# Altium schematic sheet Power_input.SchDoc
size A4; PageSetup: Record=PageOptions|CenterHorizontal=True|CenterVertical=True|PrintScale=1.00|XCorrection=1.00|YCorrection=1.00|PrintKind=0|BorderSize=5000000|LeftOffset=0|BottomOffset=0|Orientation=2|PaperLength=1000|PaperWidth=1000|Scale=100|PaperSource=7|PrintQuality=-3|MediaType=1|DitherType=10|PrintScaleMode=1|PaperKind=A4|PaperIndex=9
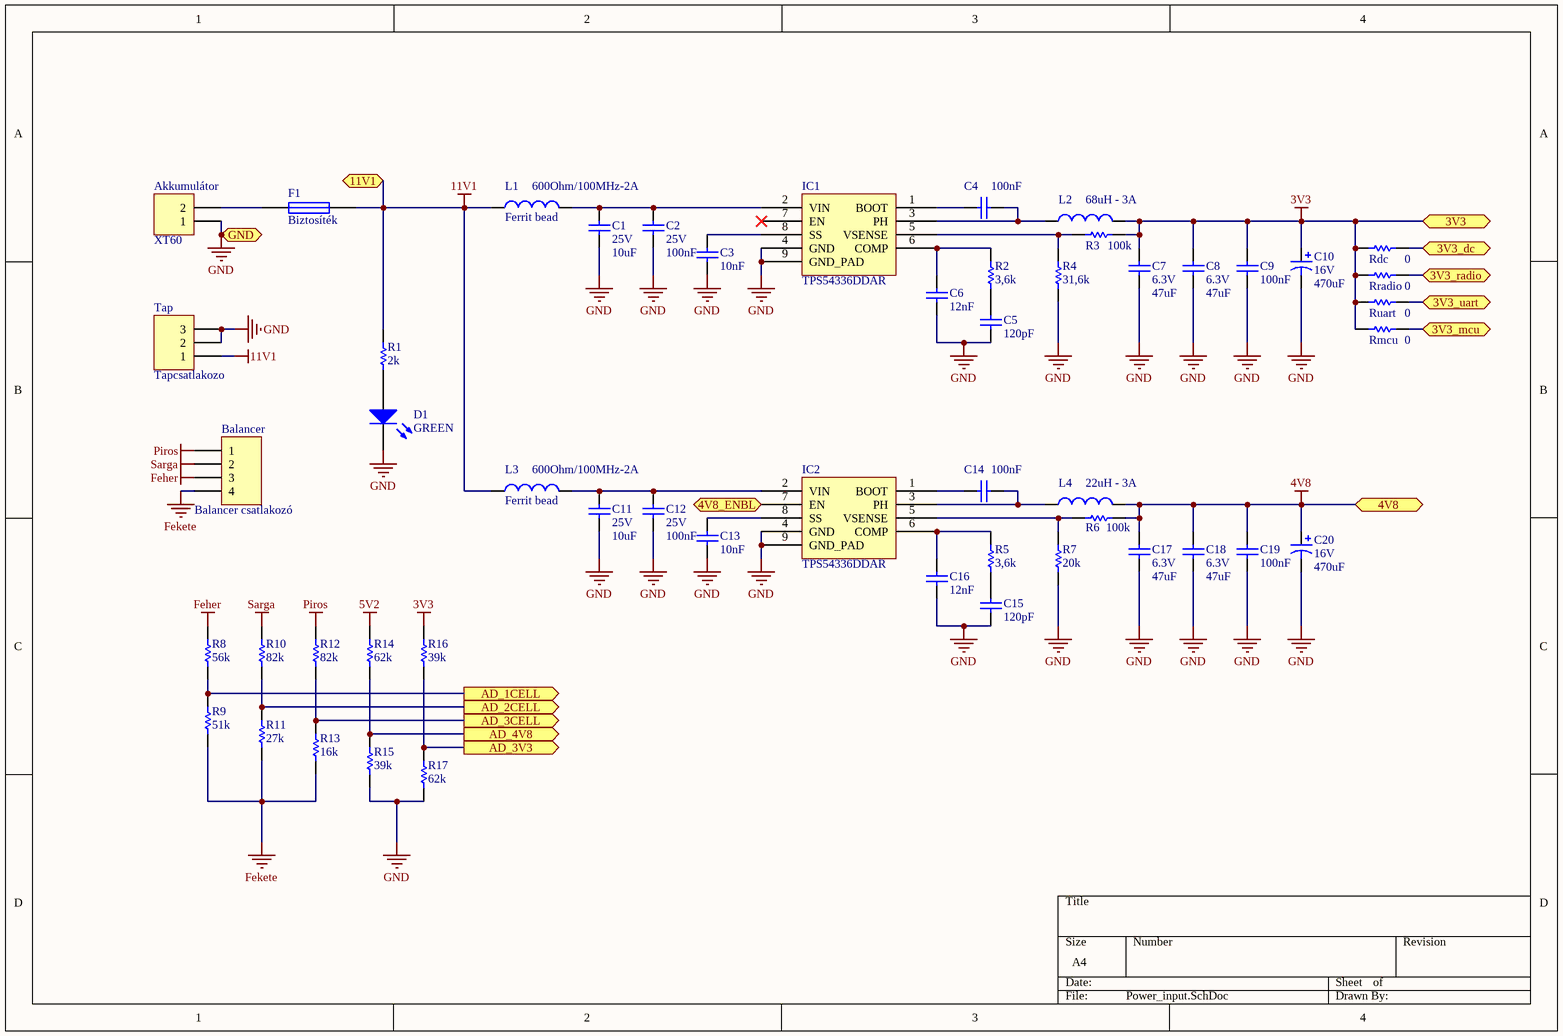
[diagram p0: Power_input.SchDoc]

## Parts
Akkumulátor  XT60  [XT60]
Balancer  Balancer csatlakozó  [FP_CONN4_TUSKE_254MM]
C1  25V  value 10uF  [FP_1206_CAP_125]
C2  25V  value 100nF  [FP_1206_CAP_125]
C3  value 10nF  [FP_0603_CAP_080]  (hidden comment: Cap)
C4  value 100nF  [FP_1206_CAP_125]  (hidden comment: Cap)
C5  value 120pF  [FP_0603_CAP_080]
C6  value 12nF  [FP_0603_CAP_080]
C7  6.3V  value 47uF  [FP_1206_CAP_125]
C8  6.3V  value 47uF  [FP_1206_CAP_125]
C9  value 100nF  [FP_1206_CAP_125]  (hidden comment: Cap)
C10  16V  value 470uF  [power_cap_10mm]
C11  25V  value 10uF  [FP_1206_CAP_125]
C12  25V  value 100nF  [FP_1206_CAP_125]
C13  value 10nF  [FP_0603_CAP_080]  (hidden comment: Cap)
C14  value 100nF  [FP_1206_CAP_125]  (hidden comment: Cap)
C15  value 120pF  [FP_0603_CAP_080]
C16  value 12nF  [FP_0603_CAP_080]
C17  6.3V  value 47uF  [FP_1206_CAP_125]
C18  6.3V  value 47uF  [FP_1206_CAP_125]
C19  value 100nF  [FP_1206_CAP_125]  (hidden comment: Cap)
C20  16V  value 470uF  [power_cap_10mm]
D1  GREEN  [FP_1206_CAP_160]
F1  Biztosíték  [autosarus_foglalat]
IC1  TPS54336DDAR  [SOIC8_thermal_pad]
IC2  TPS54336DDAR  [SOIC8_thermal_pad]
L1  Ferrit bead  value 600Ohm/100MHz-2A  [FP_0805_IND]
L2  value 68uH - 3A  [power_inductor]  (hidden comment: Inductor)
L3  Ferrit bead  value 600Ohm/100MHz-2A  [FP_0805_IND]
L4  value 22uH - 3A  [power_inductor]  (hidden comment: Inductor)
R1  value 2k  [FP_0603_RES]  (hidden comment: Res1)
R2  value 3,6k  [FP_0603_RES]  (hidden comment: Res1)
R3  value 100k  [FP_0603_RES]  (hidden comment: Res1)
R4  value 31,6k  [FP_0603_RES]  (hidden comment: Res1)
R5  value 3,6k  [FP_0603_RES]  (hidden comment: Res1)
R6  value 100k  [FP_0603_RES]  (hidden comment: Res1)
R7  value 20k  [FP_0603_RES]  (hidden comment: Res1)
R8  value 56k  [FP_0603_RES]  (hidden comment: Res1)
R9  value 51k  [FP_0603_RES]  (hidden comment: Res1)
R10  value 82k  [FP_0603_RES]  (hidden comment: Res1)
R11  value 27k  [FP_0603_RES]  (hidden comment: Res1)
R12  value 82k  [FP_0603_RES]  (hidden comment: Res1)
R13  value 16k  [FP_0603_RES]  (hidden comment: Res1)
R14  value 62k  [FP_0603_RES]  (hidden comment: Res1)
R15  value 39k  [FP_0603_RES]  (hidden comment: Res1)
R16  value 39k  [FP_0603_RES]  (hidden comment: Res1)
R17  value 62k  [FP_0603_RES]  (hidden comment: Res1)
Rdc  value 0  [FP_1206_RES]  (hidden comment: Res1)
Rmcu  value 0  [FP_1206_RES]  (hidden comment: Res1)
Rradio  value 0  [FP_1206_RES]  (hidden comment: Res1)
Ruart  value 0  [FP_1206_RES]  (hidden comment: Res1)
Tap  Tapcsatlakozo  [FP_DC_TAP_ANYA]

## Ports
3V3, 3V3_dc, 3V3_mcu, 3V3_radio, 3V3_uart, 4V8, 4V8_ENBL (in), 11V1, AD_1CELL (out), AD_2CELL (out), AD_3CELL (out), AD_3V3 (out), AD_4V8 (out), GND

## Nets
3V3: C7.1 C8.1 C9.1 C10.1 L2.2 R3.1 R16.2 Rdc.2 Rmcu.2 Rradio.2 Ruart.2 ; port 3V3
4V8: C17.1 C18.1 C19.1 C20.1 L4.2 R6.1 ; port 4V8
5V2: R14.2
11V1: F1.2 L1.1 L3.1 R1.2 Tap.1 ; port 11V1
Feher: Balancer.3 R8.2
Fekete: Balancer.4 R9.1 R11.1 R13.1
GND: Akkumulátor.1 C1.2 C2.2 C3.2 C5.2 C6.2 C7.2 C8.2 C9.2 C10.2 C11.2 C12.2 C13.2 C15.2 C16.2 C17.2 C18.2 C19.2 C20.2 D1.2(K) IC1.4(GND) IC1.9(GND_PAD) IC2.4(GND) IC2.9(GND_PAD) R4.1 R7.1 R15.1 R17.1 Tap.2 Tap.3 ; port GND
Piros: Balancer.1 R12.2
Sarga: Balancer.2 R10.2
3V3_dc: Rdc.1 ; port 3V3_dc
3V3_mcu: Rmcu.1 ; port 3V3_mcu
3V3_radio: Rradio.1 ; port 3V3_radio
3V3_uart: Ruart.1 ; port 3V3_uart
4V8_ENBL: IC2.7(EN) ; port 4V8_ENBL
AD_1CELL: R8.1 R9.2 ; port AD_1CELL
AD_2CELL: R10.1 R11.2 ; port AD_2CELL
AD_3CELL: R12.1 R13.2 ; port AD_3CELL
AD_3V3: R16.1 R17.2 ; port AD_3V3
AD_4V8: R14.1 R15.2 ; port AD_4V8
NetAkkumulátor_2: Akkumulátor.2 F1.1
NetC1_1: C1.1 C2.1 IC1.2(VIN) L1.2
NetC3_1: C3.1 IC1.8(SS)
NetC4_1: C4.1 IC1.1(BOOT)
NetC4_2: C4.2 IC1.3(PH) L2.1
NetC5_1: C5.1 R2.1
NetC6_1: C6.1 IC1.6(COMP) R2.2
NetC11_1: C11.1 C12.1 IC2.2(VIN) L3.2
NetC13_1: C13.1 IC2.8(SS)
NetC14_1: C14.1 IC2.1(BOOT)
NetC14_2: C14.2 IC2.3(PH) L4.1
NetC15_1: C15.1 R5.1
NetC16_1: C16.1 IC2.6(COMP) R5.2
NetD1_1: D1.1(A) R1.1
NetIC1_5: IC1.5(VSENSE) R3.2 R4.2
NetIC2_5: IC2.5(VSENSE) R6.2 R7.2

Not connected (* = marked no-connect by the designer): IC1 7(EN)*

## Library data of the parts
Akkumulátor = Header 2: Header, 2-Pin; LatestRevisionDate: 17-Jul-2002; LatestRevisionNote: Re-released for DXP Platform.; Publisher: Altium Limited
Balancer = Header 4: Header, 4-Pin; LatestRevisionDate: 17-Jul-2002; LatestRevisionNote: Re-released for DXP Platform.; Publisher: Altium Limited
C1-C9 C11-C19 = Cap: Capacitor; Published: 8-Jun-2000; LatestRevisionDate: 17-Jul-2002; LatestRevisionNote: Re-released for DXP Platform.; PackageReference: RAD-0.3; Publisher: Altium Limited; PackageDescription: Radial Cap, Thru-Hole; 2 Leads; 0.3 in Pin Spacing
C10 C20 = Cap Pol1: Polarized Capacitor (Radial); Published: 8-Jun-2000; LatestRevisionDate: 17-Jul-2002; LatestRevisionNote: Re-released for DXP Platform.; PackageReference: RB7.6-15; Publisher: Altium Limited; PackageDescription: Polarized Capacitor (Radial); 2 Leads
D1 = LED0: Typical INFRARED GaAs LED; Published: 8-Jun-2000; LatestRevisionDate: 08-Jul-2005; LatestRevisionNote: Mech Layer 1 removed.; PackageReference: LED-0; Publisher: Altium Limited; PackageDescription: LED; 2 Leads
F1 = Fuse 1: Fuse; Published: 8-Jun-2000; LatestRevisionDate: 17-Jul-2002; LatestRevisionNote: Re-released for DXP Platform.; PackageReference: PIN-W2/E2.8; Publisher: Altium Limited; PackageDescription: Thru-Hole; 2 Leads
IC1 IC2 = TPS54336
L1-L4 = Inductor: Code_IEC: 1005; Published: 8-Jun-2000; LatestRevisionDate: 29-May-2009; LatestRevisionNote: IPC-7351 Footprint Added.; PackageReference: 0402-A; Publisher: Altium Limited; PackageDescription: Chip Inductor; Code_JEITA: 0402
R1-R17 Rdc Rmcu Rradio Ruart = Res1: Resistor; Published: 8-Jun-2000; LatestRevisionDate: 17-Jul-2002; LatestRevisionNote: Re-released for DXP Platform.; PackageReference: AXIAL-0.3; Publisher: Altium Limited; PackageDescription: Axial Device, Thru-Hole; 2 Leads; 0.3 in Pin Spacing
Tap = Header 3: Header, 3-Pin; LatestRevisionDate: 17-Jul-2002; LatestRevisionNote: Re-released for DXP Platform.; Publisher: Altium Limited